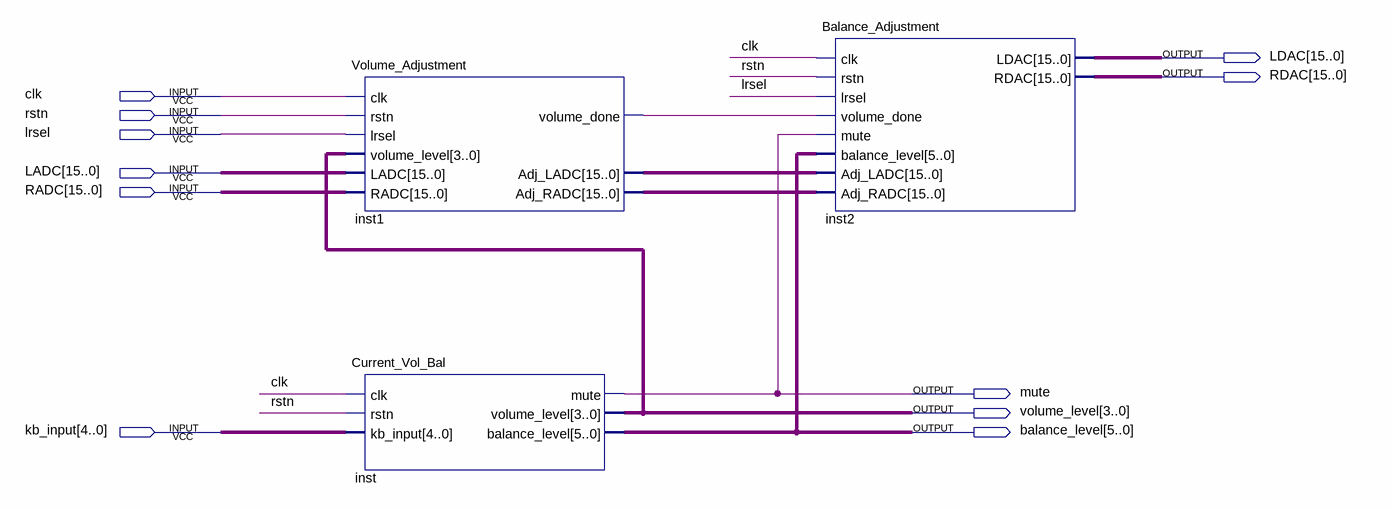
[diagram p0: schematic sheet]
// Quartus schematic Vol_Bal.bdf as structural Verilog: 3 symbols, 11 pins
module Vol_Bal (
  input  clk,
  input  rstn,
  input  lrsel,
  input  [15:0] LADC,
  input  [15:0] RADC,
  input  [4:0] kb_input,
  output [15:0] LDAC,
  output [15:0] RDAC,
  output mute,
  output [3:0] volume_level,
  output [5:0] balance_level
);

  wire inst1_volume_done;
  wire [15:0] inst1_adj_ladc, inst1_adj_radc;

  Volume_Adjustment inst1 (
    .clk(clk), .rstn(rstn), .lrsel(lrsel), .volume_level(volume_level), .LADC(LADC), .RADC(RADC),
    .volume_done(inst1_volume_done), .Adj_LADC(inst1_adj_ladc), .Adj_RADC(inst1_adj_radc));
  Current_Vol_Bal inst (
    .clk(clk), .rstn(rstn), .kb_input(kb_input), .mute(mute), .volume_level(volume_level),
    .balance_level(balance_level));
  Balance_Adjustment inst2 (
    .clk(clk), .rstn(rstn), .lrsel(lrsel), .volume_done(inst1_volume_done), .mute(mute),
    .balance_level(balance_level), .Adj_LADC(inst1_adj_ladc), .Adj_RADC(inst1_adj_radc), .LDAC(LDAC),
    .RDAC(RDAC));
endmodule
